# Altium schematic sheet programmer.SchDoc
size A; SheetNumber: 1; SheetTotal: 7
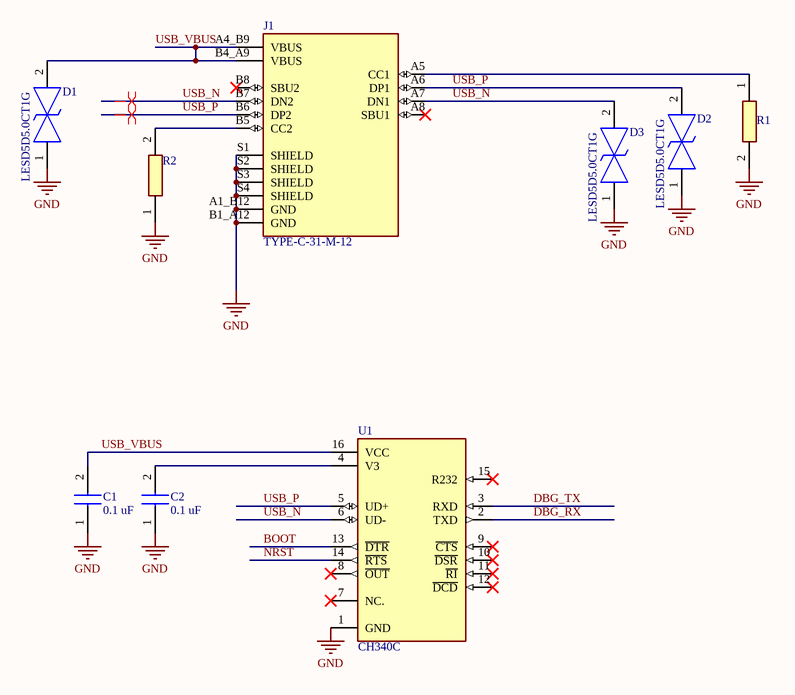
[diagram p0: programmer.SchDoc]

## Parts
C1  0.1 uF  [CAP0603]
C2  0.1 uF  [CAP0603]
D1  LESD5D5.0CT1G  [LESD5D50CT1G]
D2  LESD5D5.0CT1G  [LESD5D50CT1G]
D3  LESD5D5.0CT1G  [LESD5D50CT1G]
J1  TYPE-C-31-M-12  [HRO_TYPE-C-31-M-12]
R1  CRCW0402100KFKEDHP  [RESC1005X40N]  (value not drawn)
R2  CRCW0402100KFKEDHP  [RESC1005X40N]  (value not drawn)
U1  CH340C  [SOIC127P600X180-16N]

## Nets
GND: C1.1 C2.1 D1.1 D2.1 D3.1 J1.A1_B12(GND) J1.B1_A12(GND) J1.S1(SHIELD) J1.S2(SHIELD) J1.S3(SHIELD) J1.S4(SHIELD) R1.2 R2.1 U1.1(GND)
BOOT: U1.13(~{DTR})
DBG_RX: U1.2(TXD)
DBG_TX: U1.3(RXD)
NRST: U1.14(~{RTS})
USB_N: D3.2 J1.A7(DN1) J1.B7(DN2) U1.6(UD-)
USB_P: D2.2 J1.A6(DP1) J1.B6(DP2) U1.5(UD+)
USB_VBUS: C1.2 D1.2 J1.A4_B9(VBUS) J1.B4_A9(VBUS) U1.16(VCC)
NetC2_2: C2.2 U1.4(V3)
NetJ1_A5: J1.A5(CC1) R1.1
NetJ1_B5: J1.B5(CC2) R2.2

Not connected (* = marked no-connect by the designer): J1 A8(SBU1)* B8(SBU2)*; U1 7(NC.)* 8(~{OUT})* 9(~{CTS})* 10(~{DSR})* 11(~{RI})* 12(~{DCD})* 15(R232)*

## Layout directives
differential pair: USB_N, USB_P

## Library data of the parts
C1 C2 = CC0603KRX7R9BB104: Capacitor; Manufacturer_Name: YAGEO; Datasheet Link: https://componentsearchengine.com/Datasheets/2/CC0603KRX7R9BB104.pdf; Height: 0.9mm; Manufacturer_Part_Number: CC0603KRX7R9BB104; Mouser Part Number: 603-CC603KRX7R9BB104; Mouser Price/Stock: https://www.mouser.co.uk/ProductDetail/YAGEO/CC0603KRX7R9BB104?qs=vTakOoo5QyLvVCYM2ge8LQ%3D%3D; Arrow Part Number: CC0603KRX7R9BB104; Arrow Price/Stock: https://www.arrow.com/en/products/cc0603krx7r9bb104/yageo?utm_currency=USD&region=europe
D1-D3 = LESD5D5.0CT1G: TVS Diode (Bi-directional); Manufacturer_Name: LRC; Height: 0.7mm; Manufacturer_Part_Number: LESD5D5.0CT1G
J1 = TYPE-C-31-M-12: USB Connectors 24 Receptacle 1 8.94*7.3mm RoHS; MF: HRO Electronics Co., Ltd.; SnapEDA_Link: https://www.snapeda.com/parts/TYPE-C-31-M-12/HRO+Electronics+Co.%252C+Ltd./view-part/?ref=snap; Package: Package; Value: *; MP: TYPE-C-31-M-12; Check_prices: https://www.snapeda.com/parts/TYPE-C-31-M-12/HRO+Electronics+Co.%252C+Ltd./view-part/?ref=eda
R1 R2 = CRCW0402100KFKEDHP: Resistor; Manufacturer_Name: Vishay; Datasheet Link: http://www.vishay.com/docs/20035/dcrcwe3.pdf; Height: 0.4mm; Manufacturer_Part_Number: CRCW0402100KFKEDHP; Mouser Part Number: 71-CRCW0402100KFKEDH; Mouser Price/Stock: https://www.mouser.co.uk/ProductDetail/Vishay-Dale/CRCW0402100KFKEDHP?qs=k2%2FDWSARqgGFakjlJe4Ejw%3D%3D; Arrow Part Number: CRCW0402100KFKEDHP; Arrow Price/Stock: https://www.arrow.com/en/products/crcw0402100kfkedhp/vishay?utm_currency=USD&region=nac
U1 = CH340C: USB to serial chip CH340; MF: WCH; Price: None; Availability: Not in stock; MP: CH340C; Package: None; SnapEDA_Link: https://www.snapeda.com/parts/CH340C/WCH/view-part/?ref=snap; Check_prices: https://www.snapeda.com/parts/CH340C/WCH/view-part/?ref=eda; Value: *